# EAGLE schematic Schematic v22 (EAGLE 9.7.0)
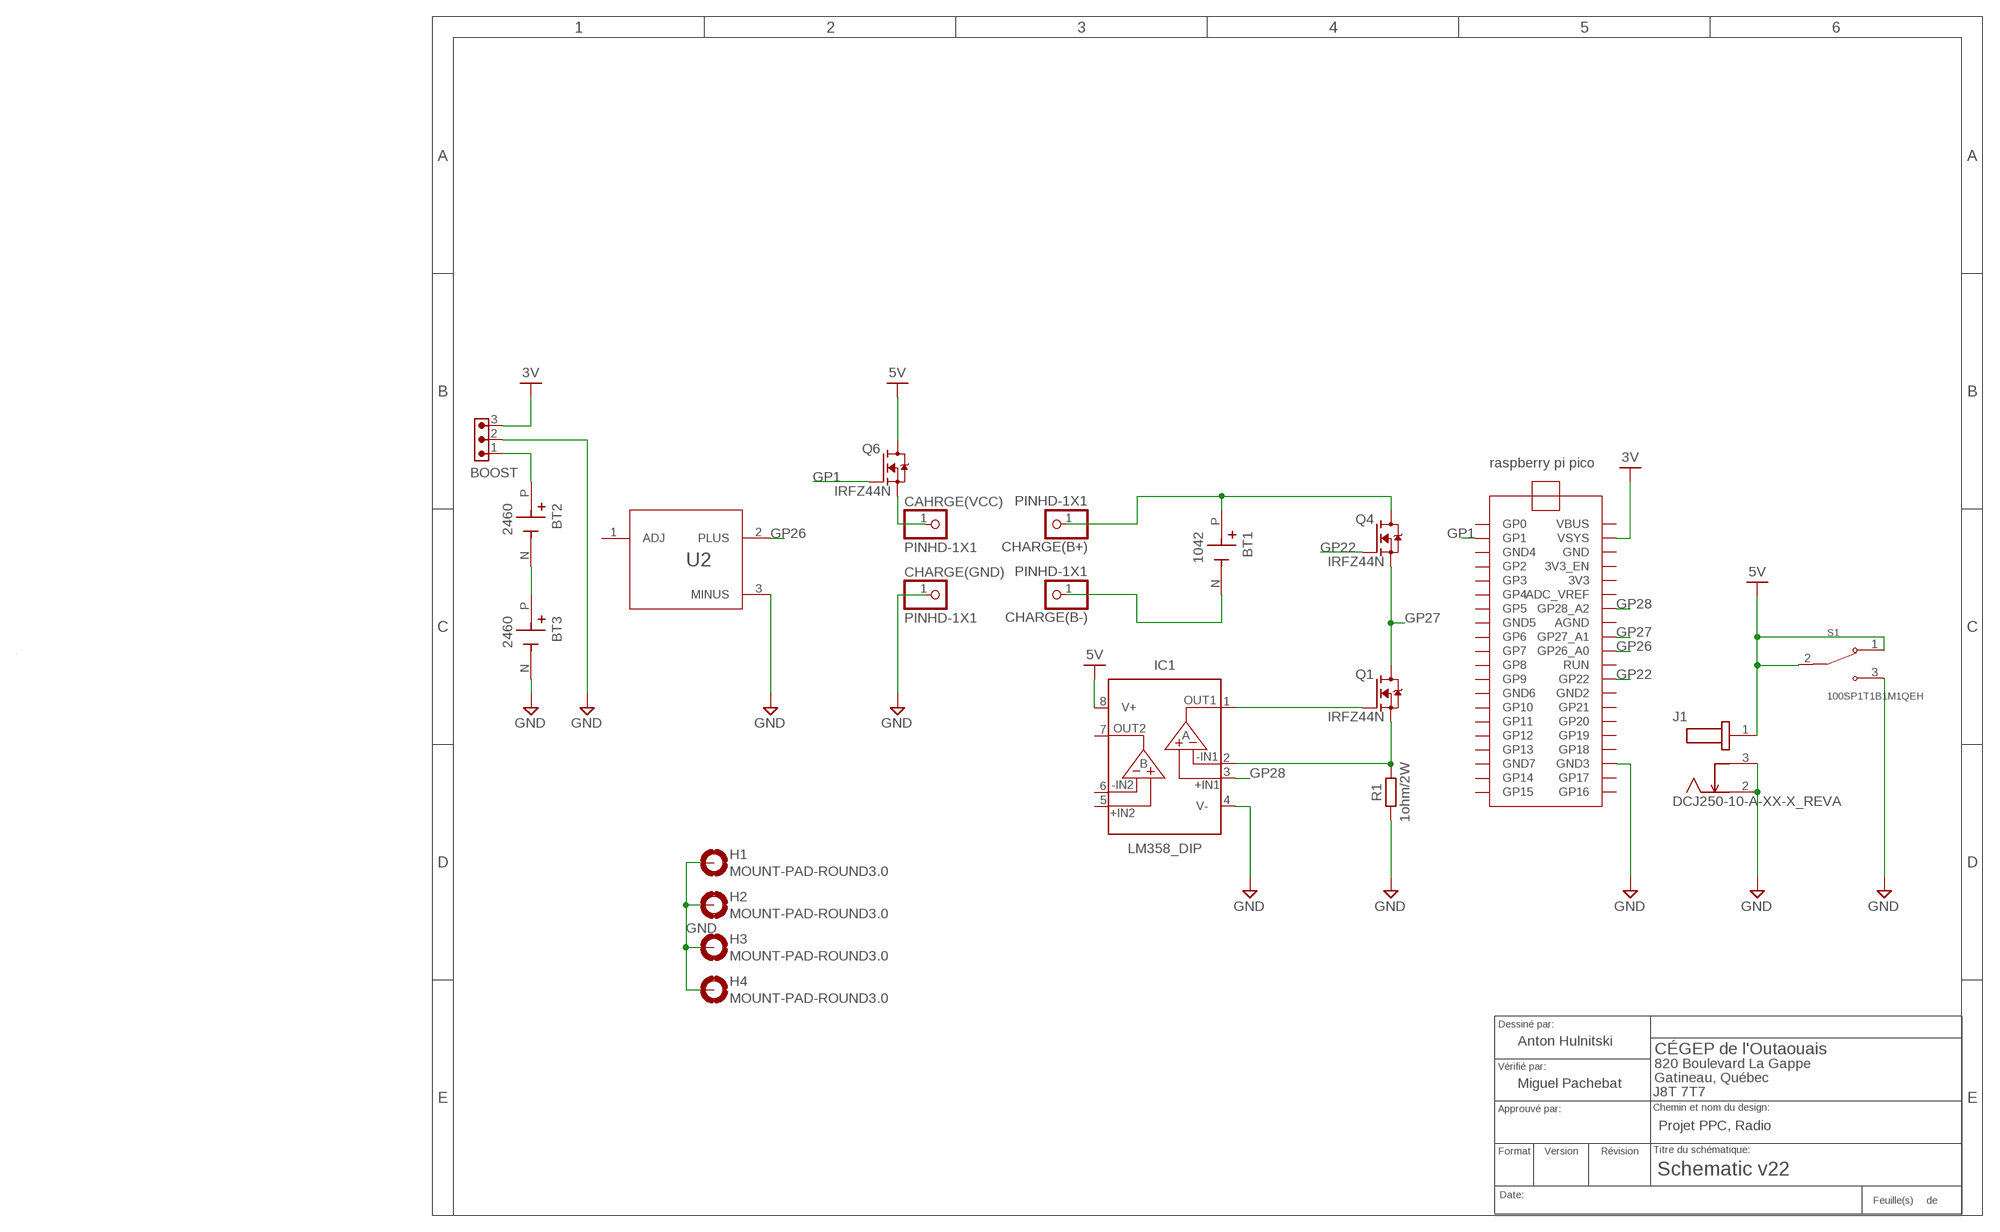
[diagram p0: schematic, sheet 1]

## Parts
BOOST  Boost  6130XX11121_61300311121  [61300311121]
BT1  1042  [BAT_1042]
BT2  2460  [BAT_2460]
BT3  2460  [BAT_2460]
CAHRGE(VCC)  PINHD-1X1  [1X01]
CHARGE(B+)  PINHD-1X1  [1X01]
CHARGE(B-)  PINHD-1X1  [1X01]
CHARGE(GND)  PINHD-1X1  [1X01]
H1  MOUNT-PAD-ROUND3.0  [3,0-PAD]
H2  MOUNT-PAD-ROUND3.0  [3,0-PAD]
H3  MOUNT-PAD-ROUND3.0  [3,0-PAD]
H4  MOUNT-PAD-ROUND3.0  [3,0-PAD]
IC1  LM358_DIP  [DIP826W53P254L959H508Q8B]
J1  DCJ250-10-A-XX-X_REVA  [GCT_DCJ250-10-A-XX-X_REVA]
Q1  IRFZ44N  IRF540NPBF  [TO254P1054X469X1930-3]
Q4  IRFZ44N  IRF540NPBF  [TO254P1054X469X1930-3]
Q6  IRFZ44N  IRF540NPBF  [TO254P1054X469X1930-3]
R1  1ohm/2W  R_AXIAL-7.2MM-PITCH  [RESAD724W46L381D178B]
S1  100SP1T1B1M1QEH  [SW_100SP1T1B1M1QEH]
U1  RASPBERRY_PI_PICO  [RASPBERRY_PI_PICO]
U2  LM335Z/NOPBLP0003A  [LP0003A]

## Nets
3V: BOOST.3 U1.VSYS
5V: IC1.8(V+) J1.1(CENTER) Q6.2(D) S1.1 S1.2
GND: BOOST.2 BT3.N(NEG) CHARGE(GND).1 H1.B3,0(MOUNT) H2.B3,0(MOUNT) H3.B3,0(MOUNT) H4.B3,0(MOUNT) IC1.4(V-) J1.2(TIP) J1.3(SHUNT) R1.1 S1.3 U1.GND3 U2.3(MINUS)
GP1: Q6.1(G) U1.GP1
GP22: Q4.1(G) U1.GP22
GP26: U1.GP26_A0 U2.2(PLUS)
GP27: Q1.2(D) Q4.3(S) U1.GP27_A1
GP28: IC1.3(+IN1) U1.GP28_A2
N$3: CAHRGE(VCC).1 Q6.3(S)
N$4: BT1.N(NEG) CHARGE(B-).1
N$5: BT1.P(POS) CHARGE(B+).1 Q4.2(D)
N$6: IC1.1(OUT1) Q1.1(G)
N$7: IC1.2(-IN1) Q1.3(S) R1.2
N$8: BT2.N(NEG) BT3.P(POS)
N$9: BOOST.1 BT2.P(POS)
Unconnected: IC1.5(+IN2) IC1.6(-IN2) IC1.7(OUT2) U1.3V3 U1.3V3_EN U1.ADC_VREF U1.AGND U1.GND U1.GND2 U1.GND4 U1.GND5 U1.GND6 U1.GND7 U1.GP0 U1.GP2 U1.GP3 U1.GP4 U1.GP5 U1.GP6 U1.GP7 U1.GP8 U1.GP9 U1.GP10 U1.GP11 U1.GP12 U1.GP13 U1.GP14 U1.GP15 U1.GP16 U1.GP17 U1.GP18 U1.GP19 U1.GP20 U1.GP21 U1.RUN U1.VBUS U2.1(ADJ)

## Notes on the sheet
- Anton Hulnitski
- Miguel Pachebat
- Projet PPC, Radio

## Library data of the parts
BOOST = 6130XX11121_61300311121:6130XX11121_61300311121: WR-PHD 2.54 mm THT Pin Header ARTICLE PROPERTIES: Pins:1;​ 2;​ 3;​ 4;​ 5;​ 6;​ 7;​ 8;​ 9;​ 10;​ 12;​ 13;​ 14;​ 15;​ 16;​ 18;​ 20;​ 22;​ 24;​ 25;​ 32;​ 36;​ 40 KIND PROPERTIES: Pitch：2.54 mm Quality Class:3 as per CECC 75 301-802 Rows：Single Gender：Pin Header Type：Straight MATERIAL PROPERTIES: Insulator Material PA6T; PBT Insulator Flammability Rating:UL94 V-0 Contact Material:Copper Alloy Contact Plating:Gold Contact Type:Stamped GENERAL INFORMATION Operating Temperature:-40 up to +105 °C ELECTRICAL PROPERTIES: Withstanding Voltage 500 V (AC) Contact Resistance 20 mΩ RISO 1000 MΩ CERTIFICATION UL Approval:E323964 PACKAGING PROPERTIES Packaging:Bag <https://www.we-online.com/catalog/media/o33211v209%20Family_BTB_PHD_6130xx11121.jpg> Details see: https://www.we-online.com/katalog/en/em/PHD_2_54_THT_PIN_HEADER_6130XX11121 Updated by Ella Wu 2021-12-08 2021 (C) Würth Elektronik; DATASHEET-URL: https://www.we-online.com/redexpert/spec/61300311121?ae; GENDER: Pin Header; IR: 3A; MOUNT: THT; PACKAGING: Bag; PART-NUMBER: 61300311121; PINS: 3; PITCH: 2.54mm; ROWS: Single; TYPE: Straight; VALUE: 61300311121
BT1 = 1042:1042; MANUFACTURER: Keystone; MAXIMUM_PACKAGE_HEIGHT: 15.11mm; PARTREV: E; SNAPEDA_PN: 1042; STANDARD: Manufacturer Recommendations
BT2 BT3 = 2460:2460; MANUFACTURER: Keystone; MAXIMUM_PACKAGE_HEIGHT: 14.14mm; PARTREV: B; SNAPEDA_PN: 2460; STANDARD: Manufacturer Recommendations
CAHRGE(VCC) CHARGE(B+) CHARGE(B-) CHARGE(GND) = Connector:PINHD-1X1: PIN HEADER; CATEGORY: Headers; DESCRIPTION: Header, Straight, 1 Position; MANUFACTURER: Generic; MPN: Generic; OPERATING_TEMPERATURE: Generic; PART_STATUS: Active; PITCH: 0.100" (2.54mm); ROHS_COMPLIANCE: Generic; SERIES: Generic; SUB-CATEGORY: Headers, Male Pins; TYPE: Board to Board or Cable, Unshrouded, Through Hole, Straight
H1-H4 = holes:MOUNT-PAD-ROUND: MOUNTING PAD, round
IC1 = IC_Linear:LM358: Dual Operational Amplifier Reference Datasheet <https://www.ti.com/lit/ds/symlink/lm158-n.pdf>; CATEGORY: Amplifier; DESCRIPTION: Dual Operational Amplifier; MANUFACTURER: Generic; MPN: Generic; SERIES: LM358; SUB-CATEGORY: OpAmp; TYPE: Dual
J1 = DCJ250-10-A-XX-X_REVA:DCJ250-10-A-XX-X_REVA; MANUFACTURER: Global Connector Technology; MAXIMUM_PACKAGE_HEIGHT: 11 mm; PARTREV: A; SNAPEDA_PN: DCJ250-10-A-K1-K; STANDARD: Manufacturer Recommendations
Q1 Q4 Q6 = IRF540NPBF:IRF540NPBF; MANUFACTURER: Infineon; MAXIMUM_PACKAGE_HEIGHT: 19.3 mm; PARTREV: 11/3/03; SNAPEDA_PN: IRF540NPBF; STANDARD: IPC 7351B
R1 = Resistor:R: Resistor Fixed - Generic; CATEGORY: Resistor; SUB-CATEGORY: Fixed
S1 = 100SP1T1B1M1QEH:100SP1T1B1M1QEH: Toggle Switch SPDT Panel Mount; MANUFACTURER: E-switch; MAXIMUM_PACKAGE_HEIGHT: 30.21 mm; PARTREV: D; STANDARD: IPC 7351B
U1 = RASPBERRY_PI_PICO:RASPBERRY_PI_PICO: Check availability <https://pricing.snapeda.com/parts/RASPBERRY%20PI%20PICO/Raspberry%20Pi/view-part?ref=eda>; AVAILABILITY: In Stock; CHECK_PRICES: https://www.snapeda.com/parts/RASPBERRY%20PI%20PICO/Raspberry+Pi/view-part/?ref=eda; DESCRIPTION: Raspberry Pi Board, Arm Cortex-M0+; Core Architecture:Arm; Core Sub-Architecture:Cortex-M0+; Kit Contents:Raspberry Pi Pico Board; No. Of Bits:32Bit; Silicon Core Number:Rp2040; Silicon Manufacturer:Raspberry Pi |Raspberry-Pi RASPBERRY PI PICO; MF: Raspberry Pi; MP: RASPBERRY PI PICO; PACKAGE: None; PRICE: None; SNAPEDA_LINK: https://www.snapeda.com/parts/RASPBERRY%20PI%20PICO/Raspberry+Pi/view-part/?ref=snap
U2 = LM335:LM335Z/NOPB; COPYRIGHT: Copyright (C) 2024 Ultra Librarian. All rights reserved.; MANUFACTURER_PART_NUMBER: LM335Z/NOPB; MFR_NAME: Texas Instruments